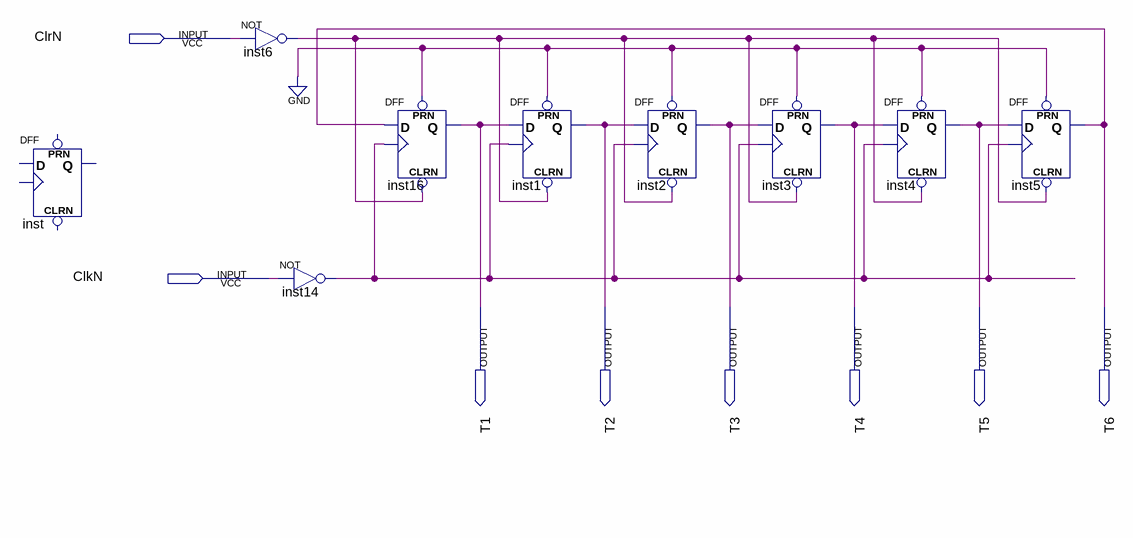
[diagram p0: schematic sheet]
// Quartus schematic ContadorAnel.bdf as structural Verilog: 9 symbols, 8 pins
module ContadorAnel (
  input  ClrN,
  input  ClkN,
  output T1,
  output T2,
  output T3,
  output T4,
  output T5,
  output T6
);

  wire inst6_out, inst14_out;

  DFF inst ();  // open: CLRN, CLK, D, PRN, Q
  not inst6 (inst6_out, ClrN);
  not inst14 (inst14_out, ClkN);
  DFF inst16 (.CLRN(inst6_out), .CLK(inst14_out), .D(T6), .PRN(1'b0), .Q(T1));
  DFF inst1 (.CLRN(inst6_out), .CLK(inst14_out), .D(T1), .PRN(1'b0), .Q(T2));
  DFF inst2 (.CLRN(inst6_out), .CLK(inst14_out), .D(T2), .PRN(1'b0), .Q(T3));
  DFF inst3 (.CLRN(inst6_out), .CLK(inst14_out), .D(T3), .PRN(1'b0), .Q(T4));
  DFF inst4 (.CLRN(inst6_out), .CLK(inst14_out), .D(T4), .PRN(1'b0), .Q(T5));
  DFF inst5 (.CLRN(inst6_out), .CLK(inst14_out), .D(T5), .PRN(1'b0), .Q(T6));
endmodule
